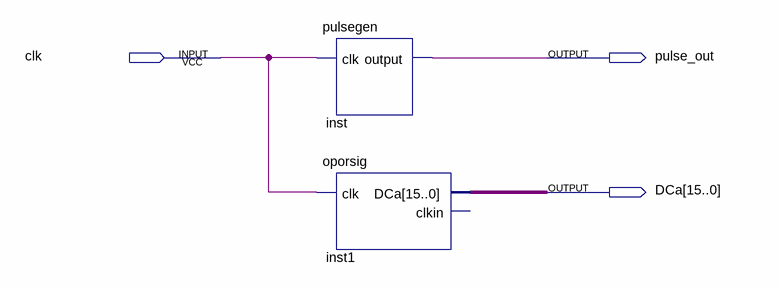
[diagram p0: schematic sheet]
// Quartus schematic unit.bdf as structural Verilog: 2 symbols, 3 pins
module unit (
  input  clk,
  output pulse_out,
  output [15:0] DCa
);

  pulsegen inst (.clk(clk), .\output (pulse_out));
  oporsig inst1 (.clk(clk), .DCa(DCa));  // open: clkin
endmodule
